# EAGLE design Teensy-Maxuino-Slave-A4988-stepper shield (EAGLE 6.4)
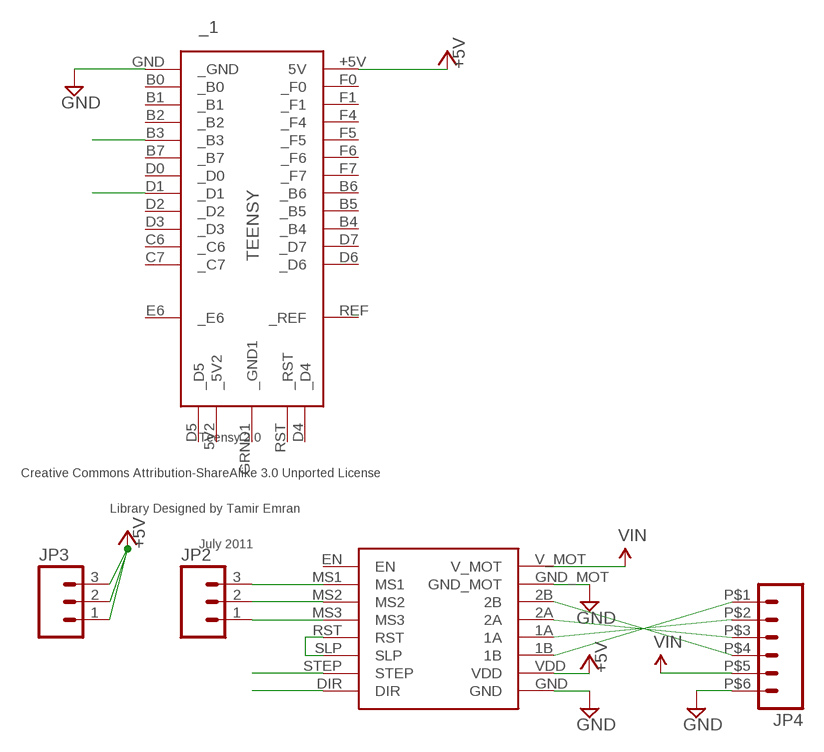
[diagram p0: schematic, sheet 1]

## Parts
_1  TEENSY  [TEENSY]
JP2  M03PTH  [1X03]
JP3  M03PTH  [1X03]
JP4  M06  [SPRINGTERMINAL-2.54MM-6]
U$1  POLOLU_A4988  [POLOLU_A4988]

## Nets
+5V: _1.+5V(5V) JP3.1 JP3.2 JP3.3 U$1.VDD
DIR: _1.D1(_D1) U$1.DIR
GND: _1.GND(_GND) JP4.P$6 U$1.GND U$1.GND_MOT
N$1: JP4.P$4 U$1.2B
N$2: JP4.P$3 U$1.2A
N$3: JP4.P$2 U$1.1A
N$4: JP4.P$1 U$1.1B
N$6: U$1.RST U$1.SLP
N$8: JP2.3 U$1.MS1
N$9: JP2.2 U$1.MS2
N$10: JP2.1 U$1.MS3
STEP: _1.B3(_B3) U$1.STEP
VIN [Power]: JP4.P$5 U$1.V_MOT
Unconnected: _1.5V2(_5V2) _1.B0(_B0) _1.B1(_B1) _1.B2(_B2) _1.B4(_B4) _1.B5(_B5) _1.B6(_B6) _1.B7(_B7) _1.C6(_C6) _1.C7(_C7) _1.D0(_D0) _1.D2(_D2) _1.D3(_D3) _1.D4(_D4) _1.D5(_D5) _1.D6(_D6) _1.D7(_D7) _1.E6(_E6) _1.F0(_F0) _1.F1(_F1) _1.F4(_F4) _1.F5(_F5) _1.F6(_F6) _1.F7(_F7) _1.GRND1(_GND1) _1.REF(_REF) _1.RST(_RST) U$1.EN

## Library data of the parts
_1 = aliEagleLib:TEENSY: Teensy 2.0 Original Design by Clint Fisher Modified Design by Tamir Emran Licensed Under Creative Commons Attribution-ShareAlike 3.0 Unported (CC BY-SA 3.0)
JP2 JP3 = SparkFun-Connectors:M03: Header 3 Standard 3-pin 0.1" header. Use with straight break away headers (SKU : PRT-00116), right angle break away headers (PRT-00553), swiss pins (PRT-00743), machine pins (PRT-00117), and female headers (PRT-00115). Molex polarized connector foot print use with SKU : PRT-08232 with associated crimp pins and housings.
JP4 = aliEagleLib:M06: Header 6 Standard 6-pin 0.1" header. Use with straight break away headers (SKU : PRT-00116), right angle break away headers (PRT-00553), swiss pins (PRT-00743), machine pins (PRT-00117), and female headers (PRT-00115). Molex polarized connector foot print use with SKU : PRT-08094 with associated crimp pins and housings. NOTES ON THE VARIANTS LOCK and LOCK_LONGPADS... This footprint was designed to help hold the alignment of a through-hole component (i.e. 6-pin header) while soldering it into place. You may notice that each hole has been shifted either up or down by 0.005 of an inch from it's more standard position (which is a perfectly straight line). This slight alteration caused the pins (the squares in the middle) to touch the edges of the holes. Because they are alternating, it causes a "brace" to hold the component in place. 0.005 has proven to be the perfect amount of "off-center" position when using our standard breakaway headers. Although looks a little odd when you look at the bare footprint, once you have a header in there, the alteration is very hard to notice. Also, if you push a header all the way into place, it is covered up entirely on the bottom side. This idea of altering the position of holes to aid alignment will be further integrated into the Sparkfun Library for other footprints. It can help hold any component with 3 or more connection pins.
U$1 = aliEagleLib:POLOLU_A4988

## Net classes
0 default: width 0.152 mm, clearance 0.152 mm
1 GND: width 0.406 mm, clearance 0.152 mm
2 Power: width 0.406 mm, clearance 0.152 mm

## Board
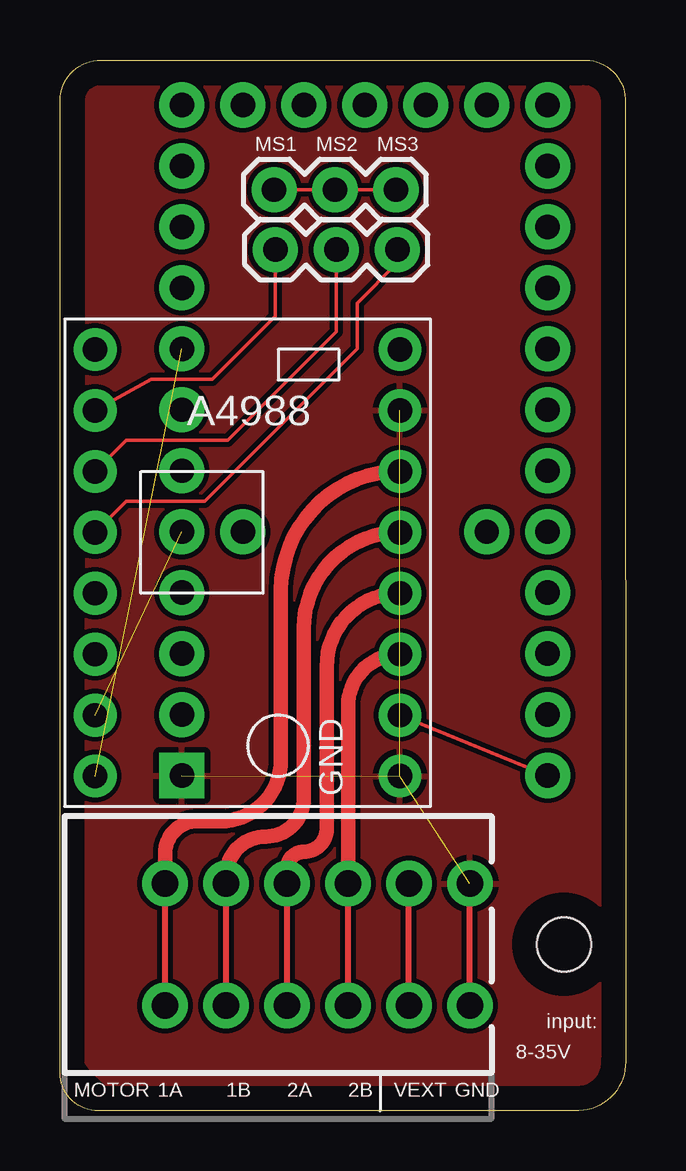
[diagram p1: board, top side]
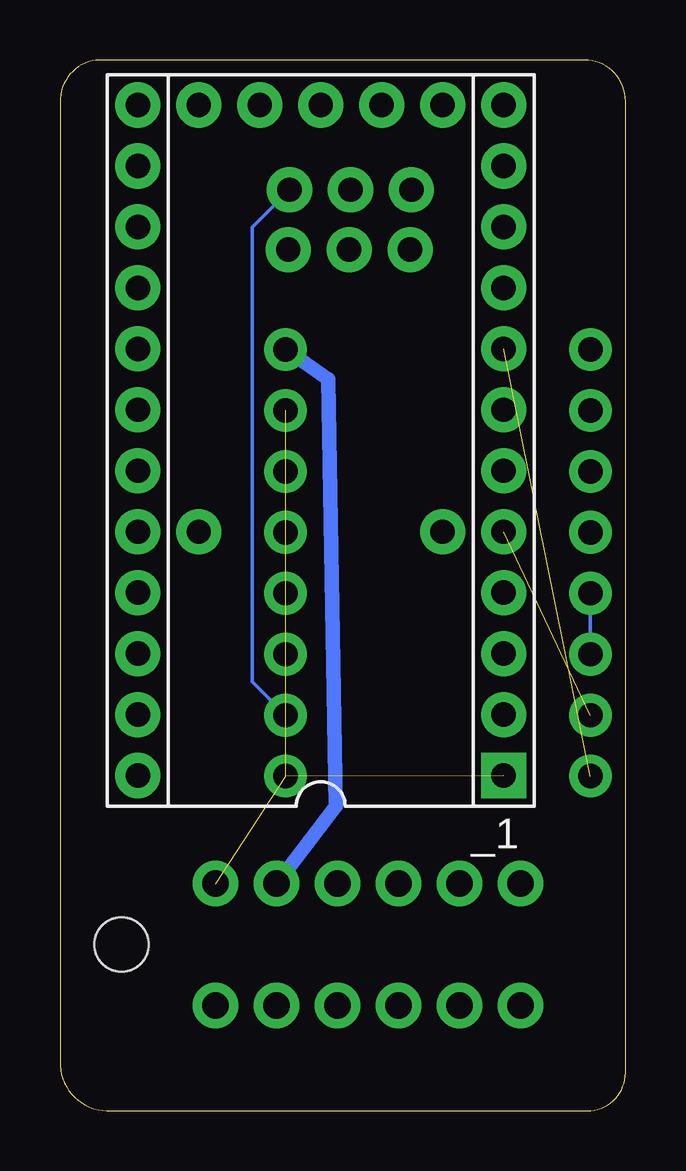
[diagram p2: board, bottom side, seen from below]

Size 23.56 x 43.78 mm. Coordinates in mm from the lower left corner, seen from the top.
Outline: 0,1.59 0,42.08 arc-90 1.71,43.78 21.75,43.78 arc-90 23.55,42.18 23.56,2.07 arc-90 21.61,0 1.59,0 arc-90 0,1.59
Copper layers (1*16): Top 0.035mm / dielectric 1.5mm / Bottom 0.035mm
Design rules "default *": minimum track width 6mil, minimum drill 24mil, track to track 8mil, track to pad 8mil, pad to pad 8mil, via to via 8mil, smd to smd 8mil, copper to edge 40mil, drill to drill 6mil, minimum pad ring 10mil, minimum via ring 8mil, stop-mask expansion 4mil, vias tented up to drill 0mil, thermal gap 10mil
Holes 2.26 mm at 31.77,24.64 20.99,6.94 32.4,19.24

### Footprints (pad centres in the part's own frame; a part is rotated, then mirrored left to right if it is on the bottom)
TEENSY = drill 1.016 pad 1.88: 5V2 13.97,-2.54; +5V -13.97,7.62; B0 -11.43,-7.62; B1 -8.89,-7.62; B2 -6.35,-7.62; B3 -3.81,-7.62; B4 8.89,7.62; B5 6.35,7.62; B6 3.81,7.62; B7 -1.27,-7.62; C6 11.43,-7.62; C7 13.97,-7.62; D0 1.27,-7.62; D1 3.81,-7.62; D2 6.35,-7.62; D3 8.89,-7.62; D4 13.97,5.08; D5 13.97,-5.08; D6 13.97,7.62; D7 11.43,7.62; E6 -3.81,-5.08; F0 -11.43,7.62; F1 -8.89,7.62; F4 -6.35,7.62; F5 -3.81,7.62; F6 -1.27,7.62; F7 1.27,7.62; GRND1 13.97,0; REF -3.81,5.08; RST 13.97,2.54 | drill 1.016 pad 1.88 square: GND -13.97,-7.62
1X03 = drill 1.016 pad 1.88: 1 0,0; 2 2.54,0; 3 5.08,0
SPRINGTERMINAL-2.54MM-6 = drill 1.1 pad 1.9: 1 2.54,-2.54; 2 0,-2.54; 3 -2.54,-2.54; 4 -5.08,-2.54; 5 5.08,-2.54; 6 7.62,-2.54; P$1 2.54,2.54; P$2 0,2.54; P$3 -2.54,2.54; P$4 -5.08,2.54; P$5 5.08,2.54; P$6 7.62,2.54
POLOLU_A4988 = drill 1.016 pad 1.778: 1A 6.35,-1.27; 1B 6.35,-3.81; 2A 6.35,1.27; 2B 6.35,3.81; DIR -6.35,-8.89; EN -6.35,8.89; GND 6.35,-8.89; GND_MOT 6.35,6.35; MS1 -6.35,6.35; MS2 -6.35,3.81; MS3 -6.35,1.27; RST -6.35,-1.27; SLP -6.35,-3.81; STEP -6.35,-6.35; V_MOT 6.35,8.89; VDD 6.35,-6.35

### Placement (x,y rotation side)
_1  12.7,27.94 90 bottom
JP2  14.06,35.88 180 top
JP3  14,38.38 180 top
JP4  9.46,6.93 0 top
U$1  7.82,22.83 0 top

### Tracks (layer width: path | path; a pad name or v marks a point on that pad's centre or on a via)
+5V
  Top 0.152: JP3.1 JP3.2 JP3.3 | _1.+5V U$1.VDD
  Bottom 0.152: JP3.1 15.56,36.82 15.56,17.88 U$1.VDD
DIR  (1 unrouted)
GND  (3 unrouted)
  pour Top: 0.66,3.27 arc90 4.01,0.59 20.37,0.59 arc90 23.07,3.09 23.04,41.13 arc90 21.49,43.01 0.72,43.03
N$1
  Top 0.61: JP4.P$4 4.38,10.73 arc-90 5.71,12.06 6.67,12.06 arc90 9.21,14.61 9.21,21.69 arc-90 U$1.2B
N$2
  Top 0.61: JP4.P$3 6.92,9.78 arc-90 8.57,11.43 arc90 10.16,13.02 10.16,20.1 arc-90 U$1.2A
N$3
  Top 0.61: JP4.P$2 9.46,10.1 arc-90 10.16,10.79 arc90 11.11,11.75 11.11,18.51 arc-90 U$1.1A
N$4
  Top 0.61: JP4.P$1 12,16.86 arc-90 U$1.1B
N$6
  Bottom 0.152: U$1.SLP U$1.RST
N$8
  Top 0.152: U$1.MS1 3.81,30.48 6.35,30.48 8.98,33.11 JP2.3
N$9
  Top 0.152: U$1.MS2 2.76,27.94 6.99,27.94 11.52,32.47 JP2.2
N$10
  Top 0.152: U$1.MS3 2.76,25.4 6.03,25.4 12.38,31.75 12.38,33.66 14.06,35.33 JP2.1
STEP  (1 unrouted)
VIN
  Bottom 0.61: JP4.P$5 12.06,12.7 12.38,30.48 U$1.V_MOT